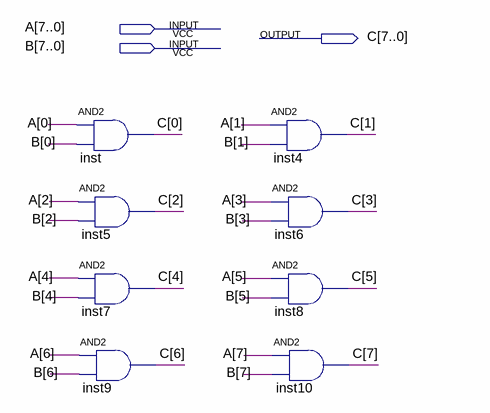
[diagram p0: schematic sheet]
// Quartus schematic AND2x8.bdf as structural Verilog: 8 symbols, 3 pins
module AND2x8 (
  input  [7:0] A,
  input  [7:0] B,
  output [7:0] C
);

  and inst (C[0], A[0], B[0]);
  and inst5 (C[2], A[2], B[2]);
  and inst7 (C[4], A[4], B[4]);
  and inst9 (C[6], A[6], B[6]);
  and inst4 (C[1], A[1], B[1]);
  and inst6 (C[3], A[3], B[3]);
  and inst8 (C[5], A[5], B[5]);
  and inst10 (C[7], A[7], B[7]);
endmodule
